# EAGLE design CCM_0012 (EAGLE 9.0.1)
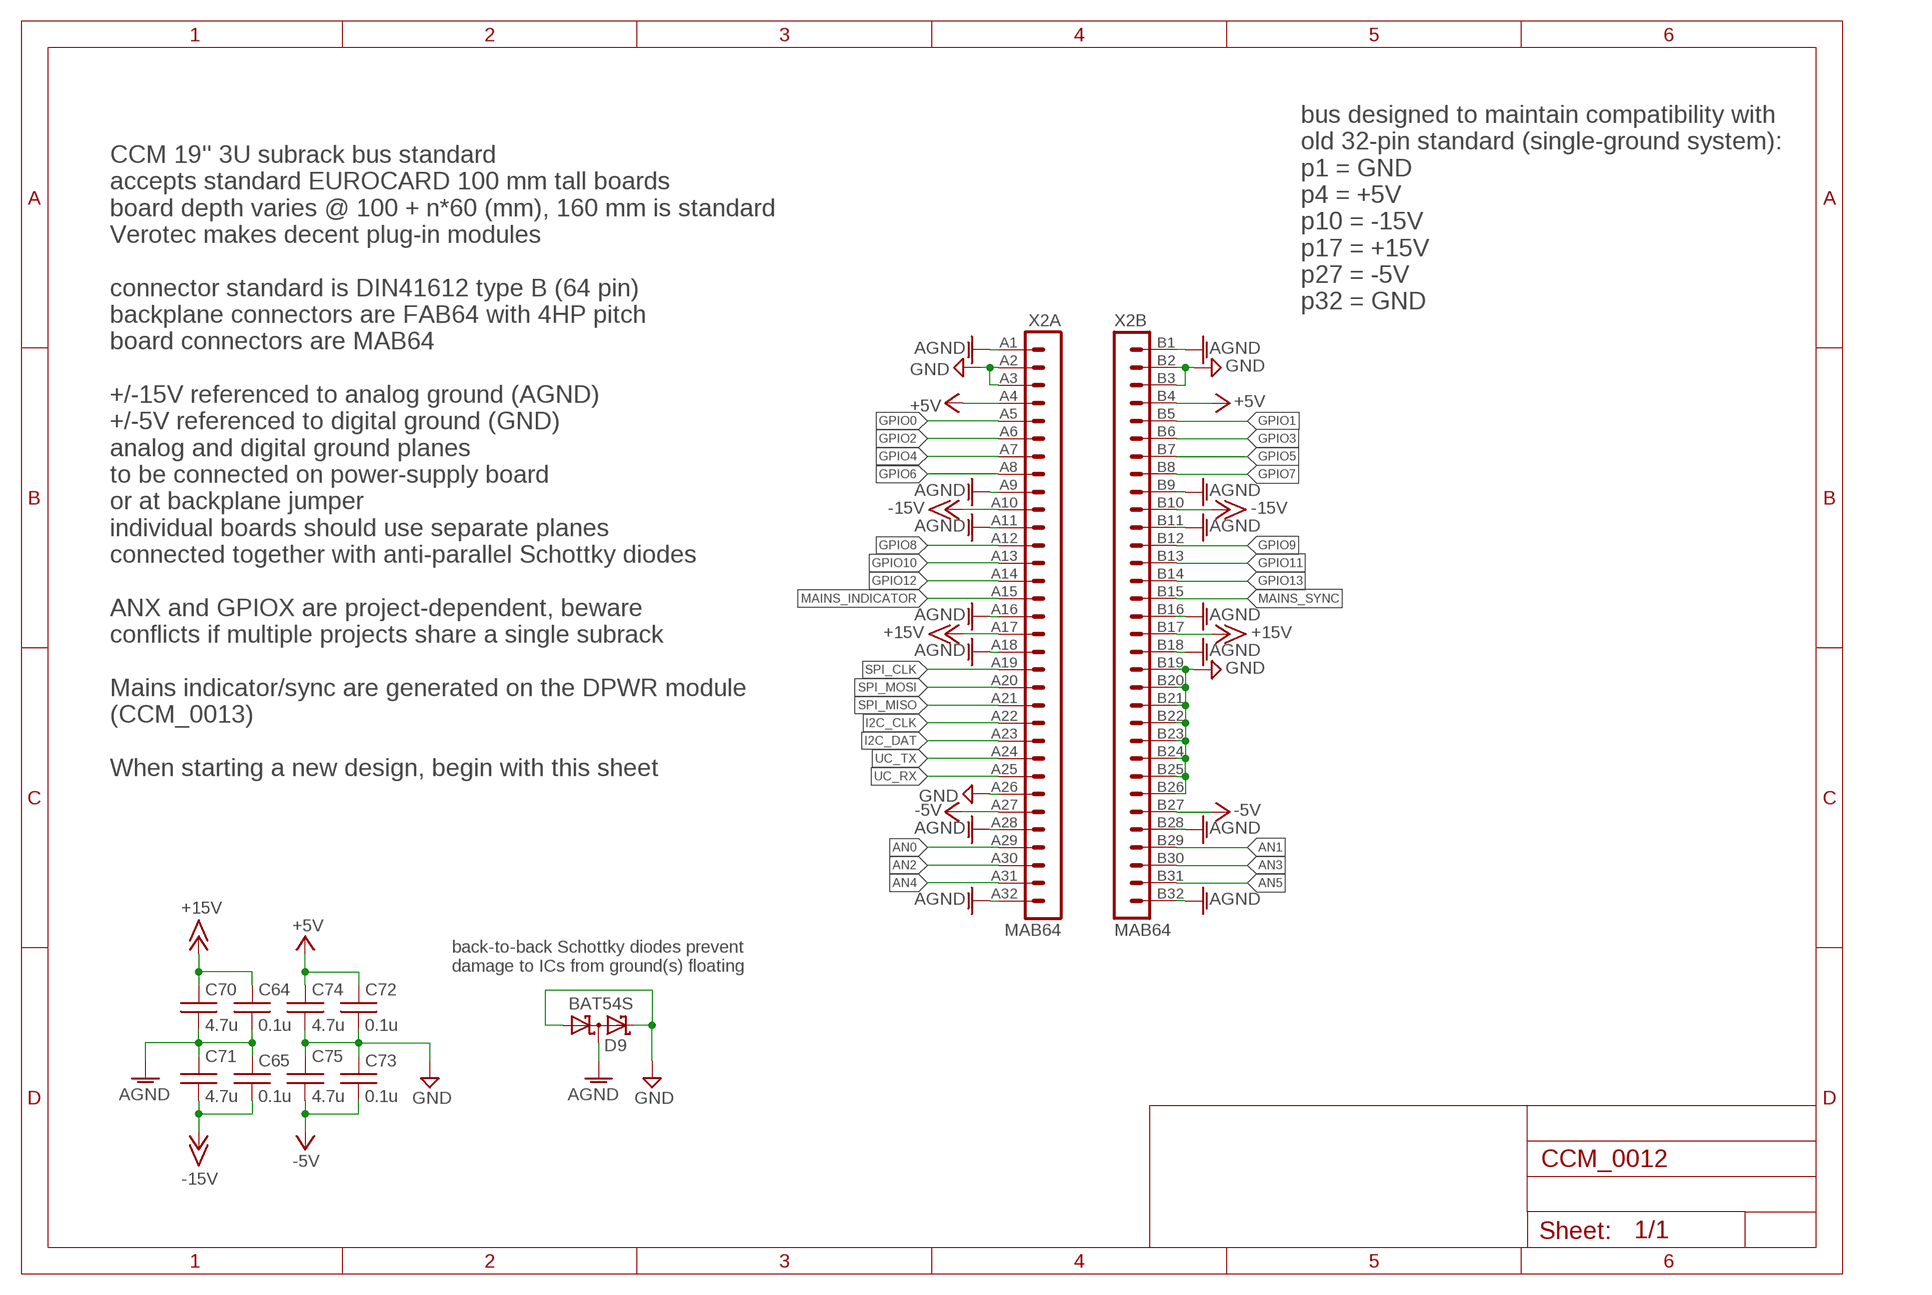
[diagram p0: schematic, sheet 1]

## Parts
C64  0.1u  C0603  [0603]
C65  0.1u  C0603  [0603]
C70  4.7u  C0603  [0603]
C71  4.7u  C0603  [0603]
C72  0.1u  C0603  [0603]
C73  0.1u  C0603  [0603]
C74  4.7u  C0603  [0603]
C75  4.7u  C0603  [0603]
D9  BAT54S  [SOT23]
X2  MAB64  [MAB64]

## Nets
+5V: C72.1 C74.1 X2.A4 X2.B4
+15V: C64.1 C70.1 X2.A17 X2.B17
-5V: C73.2 C75.2 X2.A27 X2.B27
-15V: C65.2 C71.2 X2.A10 X2.B10
AGND: C64.2 C65.1 C70.2 C71.1 D9.3(C1A2) X2.A1 X2.A9 X2.A11 X2.A16 X2.A18 X2.A28 X2.A32 X2.B1 X2.B9 X2.B11 X2.B16 X2.B18 X2.B28 X2.B32
AN0: X2.A29
AN1: X2.B29
AN2: X2.A30
AN3: X2.B30
AN4: X2.A31
AN5: X2.B31
GND: C72.2 C73.1 C74.2 C75.1 D9.1(A1) D9.2(C2) X2.A2 X2.A3 X2.A26 X2.B2 X2.B3 X2.B19 X2.B20 X2.B21 X2.B22 X2.B23 X2.B24 X2.B25 X2.B26
GPIO0: X2.A5
GPIO1: X2.B5
GPIO2: X2.A6
GPIO3: X2.B6
GPIO4: X2.A7
GPIO5: X2.B7
GPIO6: X2.A8
GPIO7: X2.B8
GPIO8: X2.A12
GPIO9: X2.B12
GPIO10: X2.A13
GPIO11: X2.B13
GPIO12: X2.A14
GPIO13: X2.B14
I2C_CLK: X2.A22
I2C_DAT: X2.A23
MAINS_INDICATOR: X2.A15
MAINS_SYNC: X2.B15
SPI_CLK: X2.A19
SPI_MISO: X2.A21
SPI_MOSI: X2.A20
UC_RX: X2.A25
UC_TX: X2.A24

## Notes on the sheet
- bus designed to maintain compatibility with 
  old 32-pin standard (single-ground system):
  p1 = GND
  p4 = +5V
  p10 = -15V
  p17 = +15V
  p27 = -5V
  p32 = GND
- CCM 19'' 3U subrack bus standard
  accepts standard EUROCARD 100 mm tall boards
  board depth varies @ 100 + n*60 (mm), 160 mm is standard
  Verotec makes decent plug-in modules
  
  connector standard is DIN41612 type B (64 pin)
  backplane connectors are FAB64 with 4HP pitch 
  board connectors are MAB64
  
  +/-15V referenced to analog ground (AGND)
  +/-5V referenced to digital ground (GND)
  analog and digital ground planes
  to be connected on power-supply board
  or at backplane jumper
  individual boards should use separate planes
  connected together with anti-parallel Schottky diodes
  
  ANX and GPIOX are project-dependent, beware 
  conflicts if multiple projects share a single subrack
  
  Mains indicator/sync are generated on the DPWR module 
  (CCM_0013)
  
  When starting a new design, begin with this sheet
- back-to-back Schottky diodes prevent 
  damage to ICs from ground(s) floating

## Library data of the parts
C64 C65 C70-C75 = acrooptics:C: Capacitor
D9 = diode:BAT54S: Schottky Diodes Pin connection corrected 2011-05-04 Source: Fairchild .. BAT54.pdf
X2 = noah:MAB64: CONNECTOR male, 94 pins, type B, rows AB, grid 2.54 mm

## Board
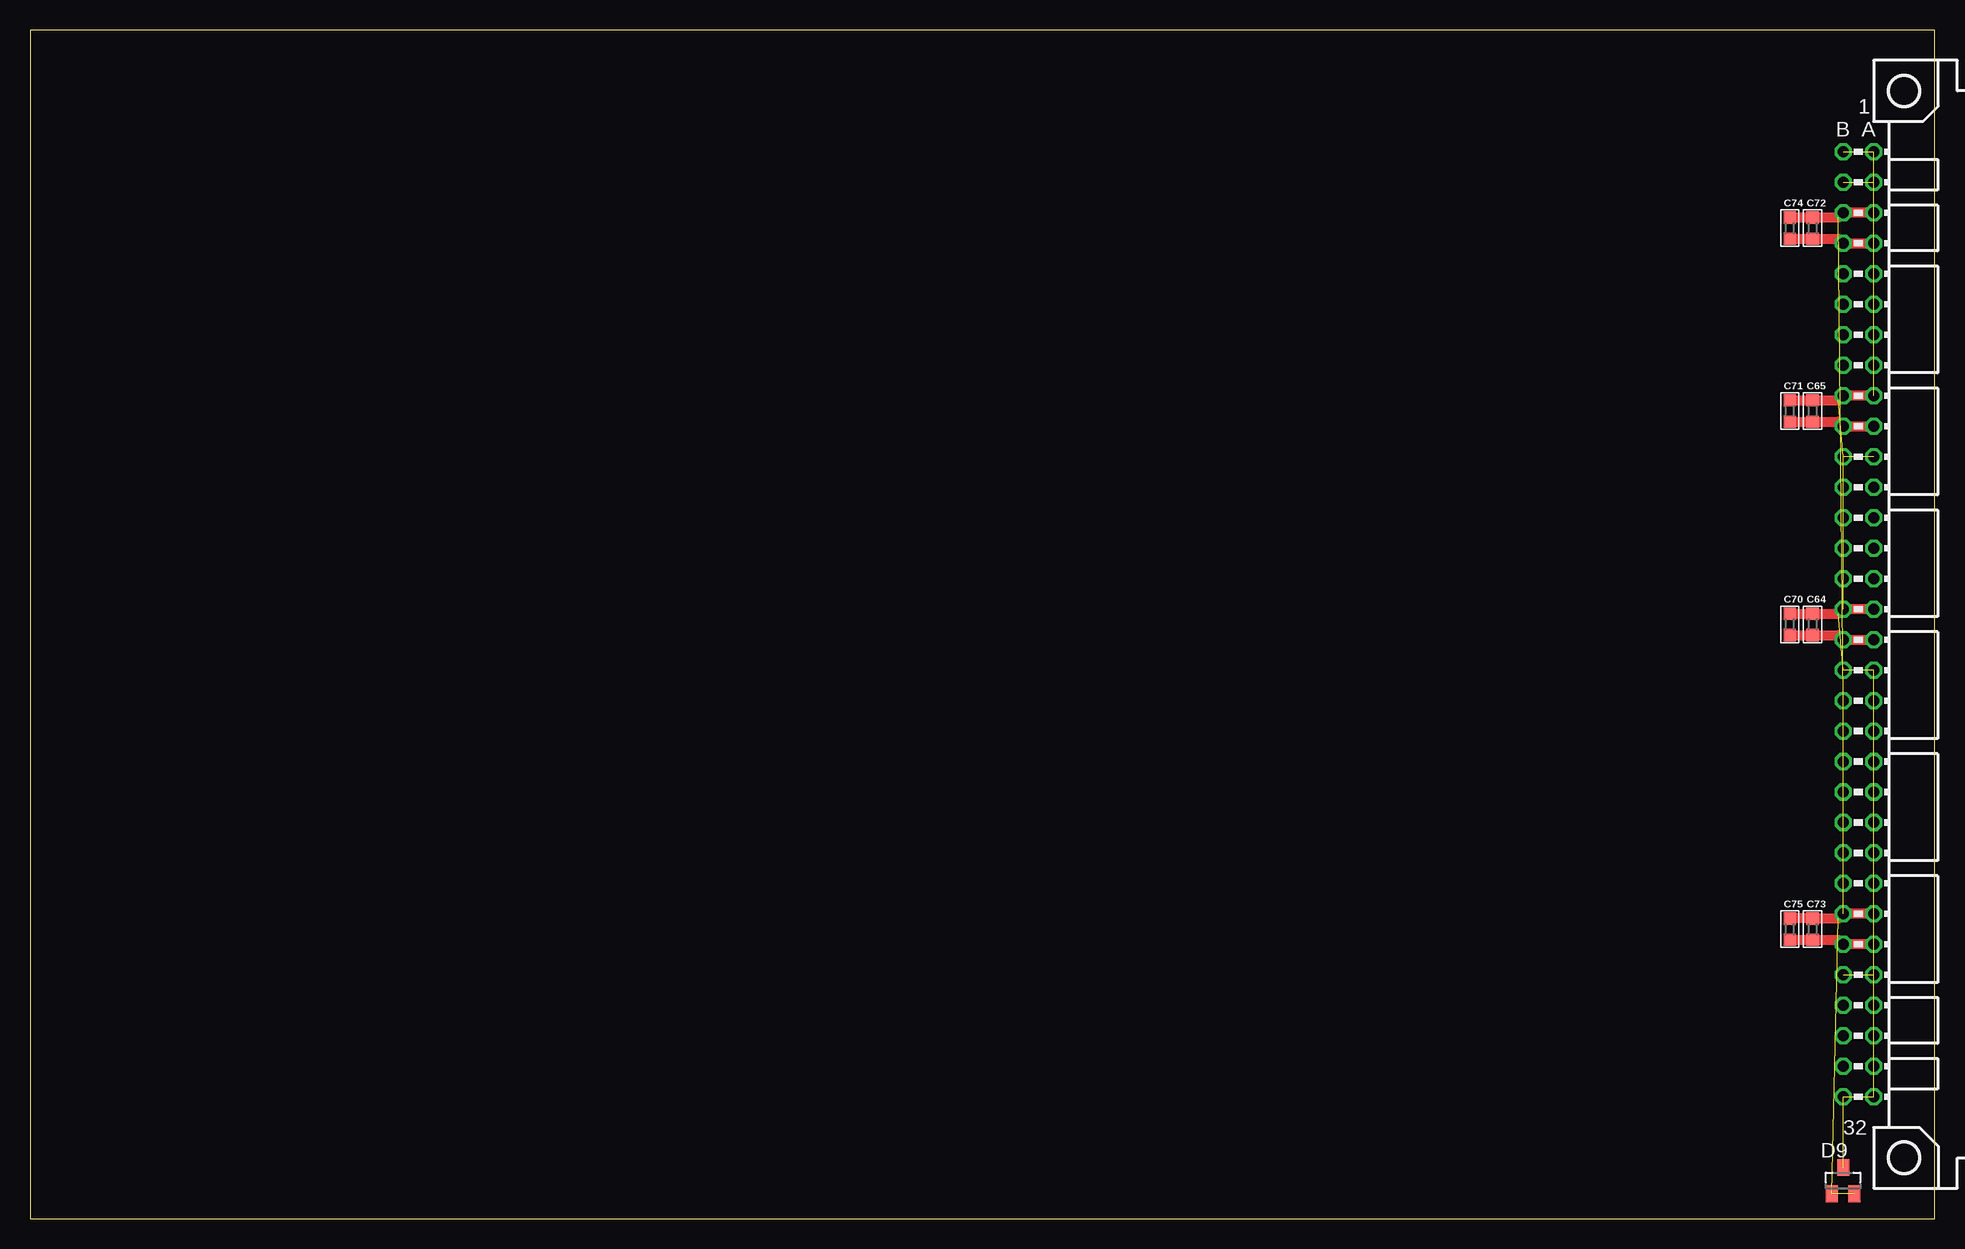
[diagram p1: board, top side]

Size 158.75 x 99.06 mm. Coordinates in mm from the lower left corner, seen from the top.
Outline: 0,0 158.75,0 158.75,99.06 0,99.06 0,0
Copper layers (1*16): Top 0.035mm / dielectric 1.5mm / Bottom 0.035mm
Design rules "default *": minimum track width 6mil, minimum drill 0.35mm, track to track 6mil, track to pad 6mil, pad to pad 6mil, via to via 6mil, smd to smd 6mil, copper to edge 40mil, drill to drill 6mil, minimum pad ring 10mil, minimum via ring 8mil, stop-mask expansion 4mil, vias tented up to drill 0mil, thermal gap 10mil

### Footprints (pad centres in the part's own frame; a part is rotated, then mirrored left to right if it is on the bottom)
0603 = smd 1.016 x 1.016: 1 -0.889,0; 2 0.889,0
SOT23 = smd 1 x 1.4: 1 -0.95,-1.1; 2 0.95,-1.1; 3 0,1.1
MAB64 = drill 0.914 octagon: A1 -2.54,39.37; A2 -2.54,36.83; A3 -2.54,34.29; A4 -2.54,31.75; A5 -2.54,29.21; A6 -2.54,26.67; A7 -2.54,24.13; A8 -2.54,21.59; A9 -2.54,19.05; A10 -2.54,16.51; A11 -2.54,13.97; A12 -2.54,11.43; A13 -2.54,8.89; A14 -2.54,6.35; A15 -2.54,3.81; A16 -2.54,1.27; A17 -2.54,-1.27; A18 -2.54,-3.81; A19 -2.54,-6.35; A20 -2.54,-8.89; A21 -2.54,-11.43; A22 -2.54,-13.97; A23 -2.54,-16.51; A24 -2.54,-19.05; A25 -2.54,-21.59; A26 -2.54,-24.13; A27 -2.54,-26.67; A28 -2.54,-29.21; A29 -2.54,-31.75; A30 -2.54,-34.29; A31 -2.54,-36.83; A32 -2.54,-39.37; B1 -5.08,39.37; B2 -5.08,36.83; B3 -5.08,34.29; B4 -5.08,31.75; B5 -5.08,29.21; B6 -5.08,26.67; B7 -5.08,24.13; B8 -5.08,21.59; B9 -5.08,19.05; B10 -5.08,16.51; B11 -5.08,13.97; B12 -5.08,11.43; B13 -5.08,8.89; B14 -5.08,6.35; B15 -5.08,3.81; B16 -5.08,1.27; B17 -5.08,-1.27; B18 -5.08,-3.81; B19 -5.08,-6.35; B20 -5.08,-8.89; B21 -5.08,-11.43; B22 -5.08,-13.97; B23 -5.08,-16.51; B24 -5.08,-19.05; B25 -5.08,-21.59; B26 -5.08,-24.13; B27 -5.08,-26.67; B28 -5.08,-29.21; B29 -5.08,-31.75; B30 -5.08,-34.29; B31 -5.08,-36.83; B32 -5.08,-39.37 | hole 2.794: 0,44.45; 0,-44.45

### Placement (x,y rotation side)
C64  148.59,49.53 90 top
C65  148.59,67.31 270 top
C70  146.69,49.53 90 top
C71  146.69,67.31 270 top
C72  148.59,82.55 90 top
C73  148.59,24.13 270 top
C74  146.69,82.55 90 top
C75  146.69,24.13 270 top
D9  151.13,3.17 0 top
X2  156.21,49.53 0 top

### Tracks (layer width: path | path; a pad name or v marks a point on that pad's centre or on a via)
+5V
  Top 0.813: C74.1 C72.1 150.75,81.66 X2.B4 X2.A4
+15V
  Top 0.813: X2.A17 X2.B17 150.75,48.64 C64.1 C70.1
-5V
  Top 0.813: X2.A27 X2.B27 150.75,23.24 C73.2 C75.2
-15V
  Top 0.813: C71.2 C65.2 150.75,66.42 X2.B10 X2.A10
AGND  (12 unrouted)
  Top 0.813: X2.A16 X2.B16 150.75,50.42 C64.2 C70.2 | X2.A9 X2.B9 150.75,68.2 C65.1 C71.1
GND  (12 unrouted)
  Top 0.813: X2.A26 X2.B26 150.75,25.02 C73.1 C75.1 | X2.A3 X2.B3 150.75,83.44 C72.2 C74.2